# EAGLE design noisegen (EAGLE 6.1)
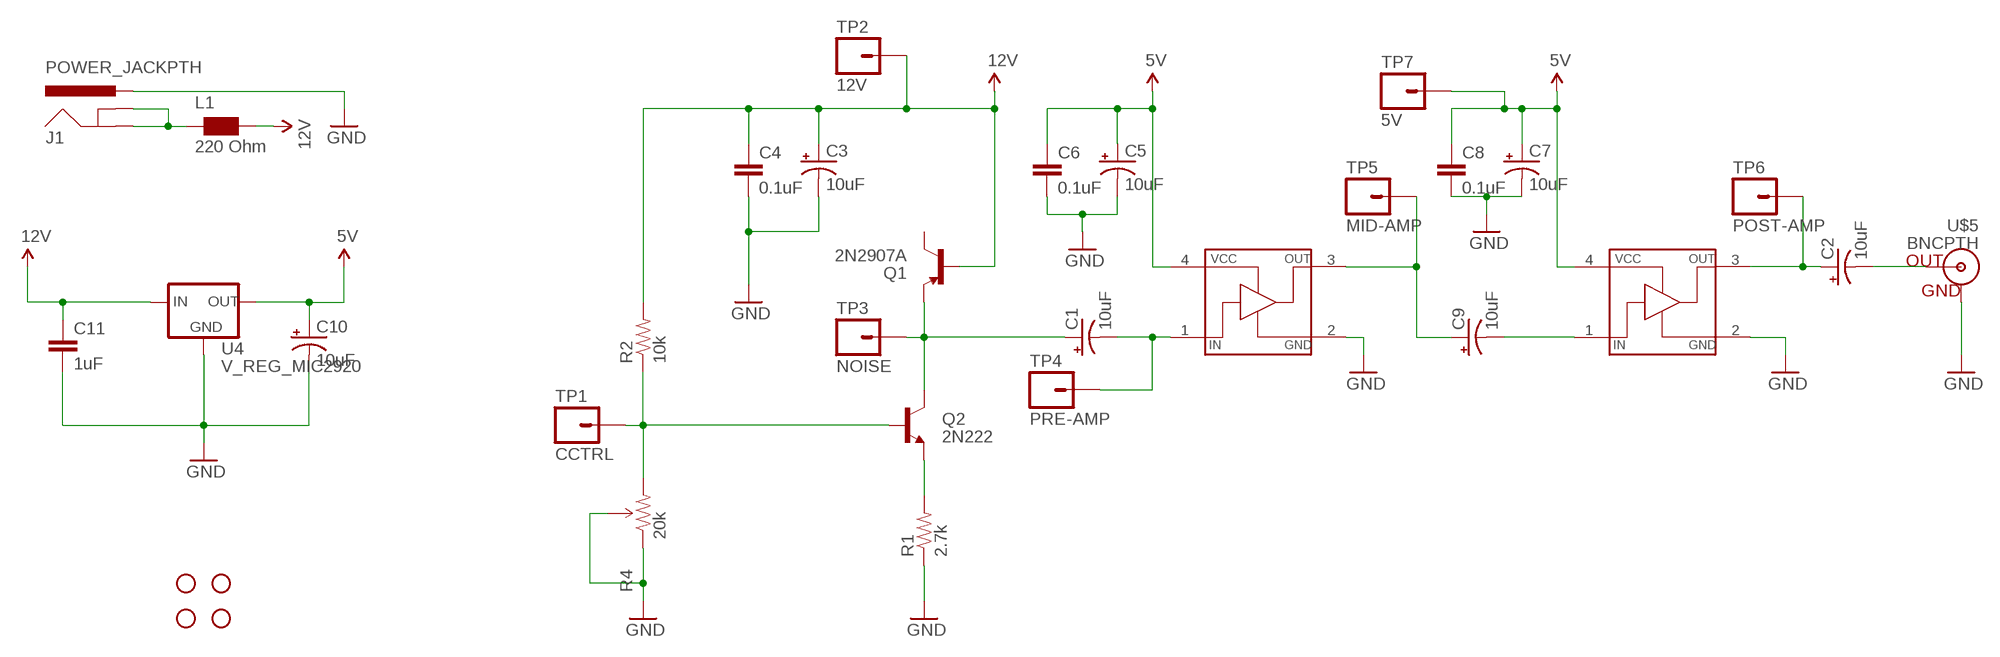
[diagram p0: schematic, sheet 1]

## Parts
C1  10uF  CAP_POL1206  [EIA3216]
C2  10uF  CAP_POL1206  [EIA3216]
C3  10uF  CAP_POL1206  [EIA3216]
C4  0.1uF  CAP0603-CAP  [0603-CAP]
C5  10uF  CAP_POL1206  [EIA3216]
C6  0.1uF  CAP0603-CAP  [0603-CAP]
C7  10uF  CAP_POL1206  [EIA3216]
C8  0.1uF  CAP0603-CAP  [0603-CAP]
C9  10uF  CAP_POL1206  [EIA3216]
C10  10uF  CAP_POL1206  [EIA3216]
C11  1uF  C-EUC0603  [C0603]
J1  POWER_JACKPTH  [POWER_JACK_PTH]
JP1  STAND-OFF  [STAND-OFF]
JP2  STAND-OFF  [STAND-OFF]
JP3  STAND-OFF  [STAND-OFF]
JP4  STAND-OFF  [STAND-OFF]
L1  220 Ohm  WE-CBF_0603  [0603]
Q1  2N2907A  TRANSISTOR_PNPSMD  [SOT23-3]
Q2  2N222  TRANSISTOR_NPNSOT23-3  [SOT23-3]
R1  2.7k  RESISTOR0603-RES  [0603-RES]
R2  10k  RESISTOR0603-RES  [0603-RES]
R4  20k  TRIMPOT  [3362U-2]
TP1  CCTRL  M01PTH  [1X01]
TP2  12V  M01PTH  [1X01]
TP3  NOISE  M01PTH  [1X01]
TP4  PRE-AMP  M01PTH  [1X01]
TP5  MID-AMP  M01PTH  [1X01]
TP6  POST-AMP  M01PTH  [1X01]
TP7  5V  M01PTH  [1X01]
U4  V_REG_MIC2920  [SOT223]
U$1  MAX2650  [SOT143]
U$2  MAX2650  [SOT143]
U$5  BNCPTH  [BNC]

## Nets
5V: C5.A(+) C6.1 C7.A(+) C8.1 C10.A(+) TP7.1 U4.3(OUT) U$1.4(VCC) U$2.4(VCC)
GND: C3.C(-) C4.2 C5.C(-) C6.2 C7.C(-) C8.2 C10.C(-) C11.2 J1.PWR R1.1 R4.1(CCW) R4.2(WIPER) U4.2(GND) U$1.2(GND) U$2.2(GND) U$5.GND
N$1: C9.C(-) U$2.1(IN)
N$2: C1.C(-) TP4.1 U$1.1(IN)
N$3: C2.A(+) TP6.1 U$2.3(OUT)
N$4: C1.A(+) Q1.2(E) Q2.3(C) TP3.1
N$5: Q2.2(E) R1.2
N$6: C2.C(-) U$5.S(OUT)
N$7: Q2.1(B) R2.1 R4.3(CW) TP1.1
N$8: C9.A(+) TP5.1 U$1.3(OUT)
N$9: J1.GND J1.GNDBREAK L1.1
VCC: C3.A(+) C4.1 C11.1 L1.2 Q1.1(B) R2.2 TP2.1 U4.1(IN) ; supply symbol labelled 12V
Unconnected: Q1.3(C)

## Library data of the parts
C1-C3 C5 C7 C9 C10 = sparkfun:CAP_POL: Capacitor Polarized These are standard SMD and PTH capacitors. Normally 10uF, 47uF, and 100uF in electrolytic and tantalum varieties. Always verify the external diameter of the through hole cap, it varies with capacity, voltage, and manufacturer. The EIA devices should be standard.
C4 C6 C8 = sparkfun:CAP: Capacitor Standard 0603 ceramic capacitor, and 0.1" leaded capacitor.
C11 = rcl:C-EU: CAPACITOR, European symbol
J1 = sparkfun:POWER_JACK: Power Jack This is the standard 5.5mm barrel jack for power. The PTH is the most common, proven, reliable, footprint. All others are experimental. The Slot footprint only works if the mill layer is transmitted to the PCB fab house so be warned. Spark Fun Electronics SKU : PRT-00119. Mating wall wart : TOL-00298 (and others)
JP1-JP4 = sparkfun:STAND-OFF: Stand Off This is the mechanical footprint for a #4 phillips button head screw. Use the keepout ring to avoid running the screw head into surrounding components. SKU : PRT-00447
L1 = wuerth-elektronik:WE-CBF: SMD EMI Suppression Ferrite Beads - excellent anti-EMI properties - low DCR - impedances till 3000 ohms - rated current up to 6 A
Q1 = sparkfun:TRANSISTOR_PNP
Q2 = sparkfun:TRANSISTOR_NPN: Transistor NPN BJT configuration in SOT23 package. MMBT2222 is the common NPN we use. Double check BCE configuration again layout.
R1 R2 = sparkfun:RESISTOR: Resistor Basic schematic elements and footprints for 0603, 1206, and PTH resistors.
R4 = sparkfun:TRIMPOT
TP1-TP7 = sparkfun:M01: Header 1 Standard 1-pin 0.1" header. Use with straight break away headers (SKU : PRT-00116), right angle break away headers (PRT-00553), swiss pins (PRT-00743), machine pins (PRT-00117), and female headers (PRT-00115).
U4 = sparkfun:V_REG_MIC2920: MIC2920A (http://www.micrel.com/_PDF/mic2920.pdf) - 400mA output LDO Regulator
U$1 U$2 = custom:MAX2650
U$5 = sparkfun:BNC: BNC Connector, Mouser Part# 5227161

## Board
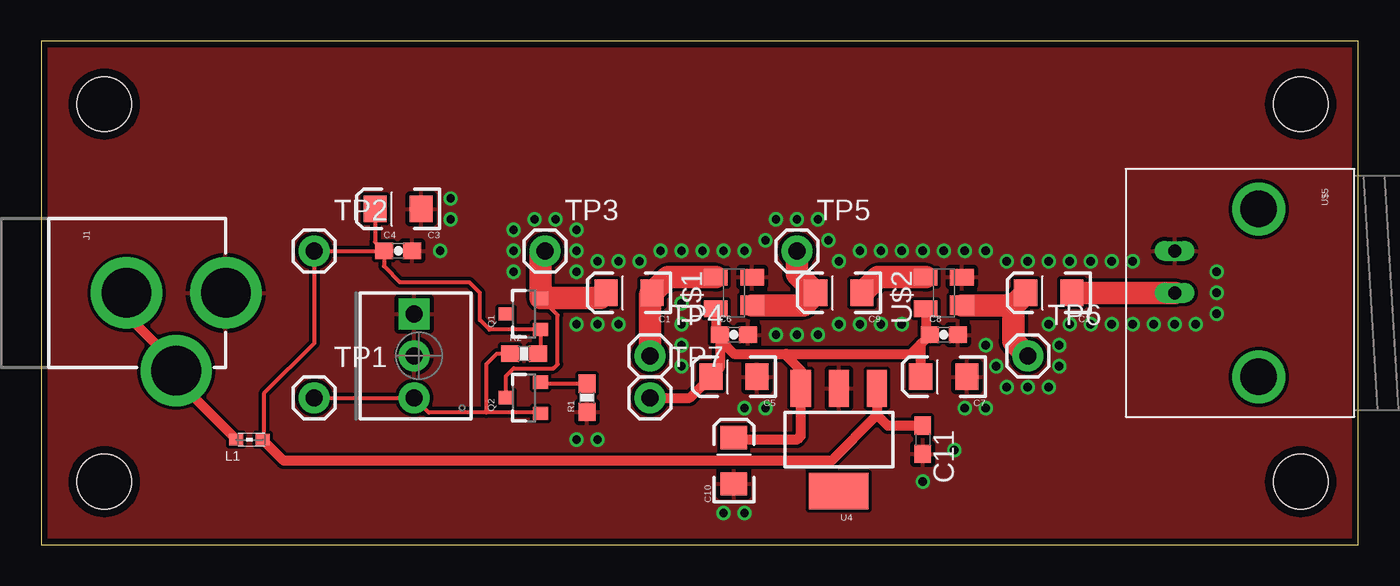
[diagram p1: board, top side]
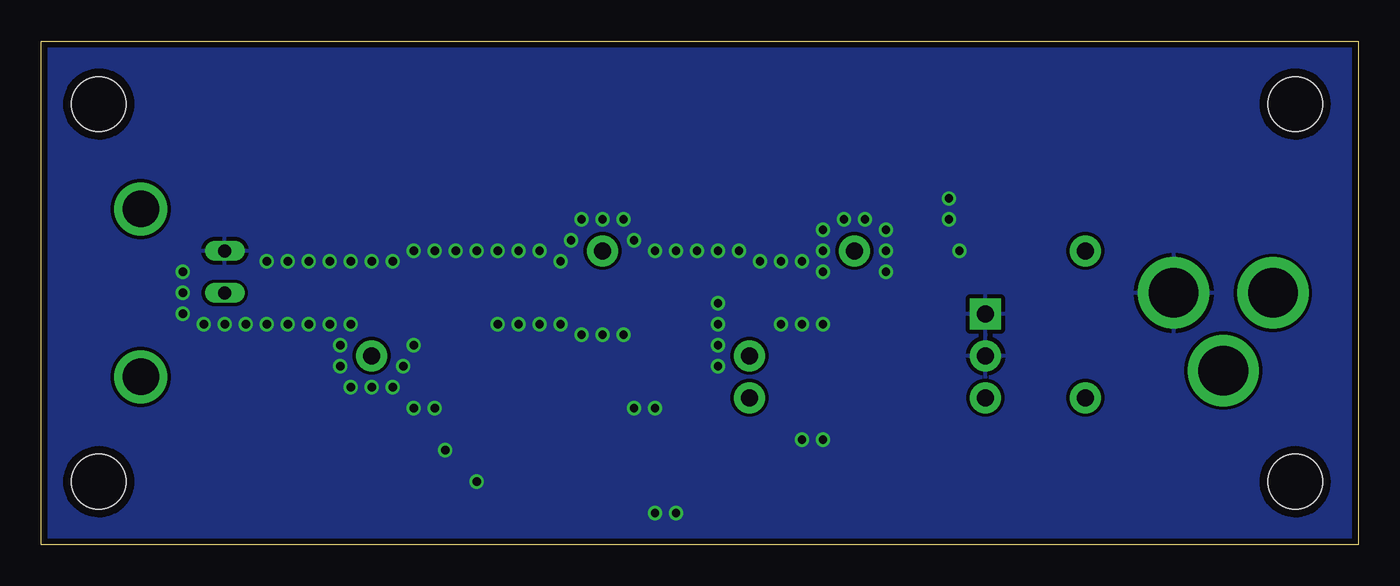
[diagram p2: board, bottom side, seen from below]

Size 79.68 x 30.47 mm. Coordinates in mm from the lower left corner, seen from the top.
Outline: 0,0 79.68,0 79.68,30.47 0,30.47 0,0
Copper layers (1*16): Top 0.0356mm / dielectric 1.5011mm / Bottom 0.0356mm
Design rules: minimum track width 6mil, minimum drill 13mil, track to track 6mil, track to pad 6mil, pad to pad 6mil, via to via 6mil, smd to smd 6mil, copper to edge 15mil, drill to drill 6mil, minimum pad ring 7mil, minimum via ring 7mil, stop-mask expansion 4mil, vias tented up to drill 0mil, thermal gap 10mil

### Footprints (pad centres in the part's own frame; a part is rotated, then mirrored left to right if it is on the bottom)
EIA3216 = smd 1.4 x 1.6: A 1.4,0; C -1.4,0
0603-CAP = smd 1.1 x 1: 1 -0.85,0; 2 0.85,0
C0603 = smd 1.1 x 1: 1 -0.85,0; 2 0.85,0
POWER_JACK_PTH = drill 2.997 pad 4.318: GND 0,7.7; GNDBREAK 4.7,10.7; PWR 0,13.7
STAND-OFF = hole 3.302: 0,0
0603 = smd 0.85 x 0.7: 1 -0.9,0; 2 0.7,0
SOT23-3 = smd 0.8 x 0.9: 1 -0.95,-1; 2 0.95,-1; 3 0,1.1
0603-RES = smd 1.1 x 1: 1 -0.85,0; 2 0.85,0
3362U-2 = drill 1.016 pad 1.88 square: 1 -2.54,-0.305 | drill 1.016 pad 1.88: 2 0,-0.305; 3 2.54,-0.305
1X01 = drill 1.016 pad 1.88: 1 0,0
SOT223 = smd 1.219 x 2.235: 1 -2.311,-3.099; 2 0,-3.099; 3 2.311,-3.099 | smd 3.6 x 2.2: 4 0,3.099
SOT143 = smd 1 x 1.44: 1 0.95,1.1; 2 0.95,-1.1; 4 -0.95,1.1 | smd 1.2 x 1.44: 3 -0.75,-1.1
BNC = drill 2.2: 3 -5.08,5.08; 4 5.08,5.08 | drill 0.8 long: GND -2.54,0; S 0,0

### Placement (x,y rotation side)
C1  35.56,15.24 180 top
C2  60.96,15.24 180 top
C3  21.59,20.32 180 top
C4  21.59,17.78 0 top
C5  41.91,10.16 180 top
C6  41.91,12.7 0 top
C7  54.61,10.16 180 top
C8  54.61,12.7 0 top
C9  48.26,15.24 180 top
C10  41.91,5.08 90 top
C11  53.34,6.35 270 top
J1  -2.54,15.24 270 top
JP1  3.81,26.67 0 top
JP2  3.81,3.81 0 top
JP3  76.2,26.67 0 top
JP4  76.2,3.81 0 top
L1  12.7,6.35 0 top
Q1  29.21,13.97 90 top
Q2  29.21,8.89 90 top
R1  33.02,8.89 90 top
R2  29.21,11.56 0 top
R4  22.86,11.43 270 top
TP1  16.51,8.89 0 top
TP2  16.51,17.78 0 top
TP3  30.48,17.78 0 top
TP4  36.83,11.43 0 top
TP5  45.72,17.78 0 top
TP6  59.69,11.43 0 top
TP7  36.83,8.89 0 top
U4  48.26,6.35 180 top
U$1  41.91,15.24 90 top
U$2  54.61,15.24 90 top
U$5  68.58,15.24 270 top

### Tracks (layer width: path | path; a pad name or v marks a point on that pad's centre or on a via)
5V
  Top 0.254: 53.51,12.95 C8.1 | C6.1 41.06,12.41 | C10.A 41.91,6.98
  Top 0.61: C7.A 53.21,12.15 | 53.21,12.15 C8.1 | U$2.4 53.51,12.95 | U$1.4 40.81,12.95 C6.1 41.06,10.71 C5.A 39.24,8.89 TP7.1 | 41.06,12.41 41.91,11.56 45.09,11.56 | 45.09,11.56 52.62,11.56 53.21,12.15 | C10.A 42.04,6.35 45.72,6.35 45.95,6.58 U4.3 45.95,9.93 | 45.95,9.93 45.72,10.16 | 45.95,9.93 45.95,10.57 45.09,11.43 45.09,11.56
GND  (via drill 0.51)
  other vias: 44.45,12.7 45.72,12.7 46.99,12.7 48.26,13.34 49.53,13.34 50.8,13.34 52.07,13.34 38.73,14.61 38.73,13.34 38.73,12.07 38.73,10.8 33.66,6.35 32.38,6.35 24.77,20.96 24.77,19.68 24.13,17.78 28.58,16.51 28.58,17.78 28.58,19.05 29.84,19.68 31.12,19.68 32.38,19.05 32.38,17.78 32.38,16.51 32.38,13.34 33.66,13.34 34.92,13.34 33.66,17.14 34.92,17.14 36.2,17.14 37.46,17.78 38.73,17.78 40.01,17.78 41.27,17.78 42.55,17.78 43.82,18.41 44.45,19.68 45.72,19.68 46.99,19.68 47.62,18.41 48.26,17.14 49.53,17.78 50.8,17.78 52.07,17.78 53.34,17.78 54.61,17.78 55.88,17.78 57.15,17.78 58.42,17.14 59.69,17.14 60.96,17.14 62.23,17.14 63.5,17.14 64.77,17.14 66.04,17.14 71.12,16.51 71.12,15.24 71.12,13.97 69.85,13.34 68.58,13.34 67.31,13.34 66.04,13.34 64.77,13.34 63.5,13.34 62.23,13.34 60.96,13.34 61.6,12.07 61.6,10.8 60.96,9.53 59.69,9.53 58.42,9.53 57.79,10.8 57.15,12.07 57.15,8.25 55.88,8.25 42.55,8.25 43.82,8.25 41.27,1.91 42.55,1.91 53.34,3.81 55.24,5.71
  pour Bottom (isolate 0.2): 80.01,30.48 0,30.48 0,0 80.01,0
  pour Top (isolate 0.2): 80.01,30.48 0,30.48 0,0 80.01,0
N$1
  Top 1.35: U$2.1 50.61,16.19 C9.C
N$2
  Top 0.254: 36.83,15.11 C1.C
  Top 1.35: U$1.1 37.91,16.19 C1.C | TP4.1 36.83,15.11
N$3
  Top 1.35: U$2.3 58.81,14.49 | 58.81,14.49 C2.A | 58.81,14.49 58.81,12.31 TP6.1
N$4
  Top 0.254: 33.84,14.92 C1.A | Q2.3 28.11,10.2 28.58,10.67 30.99,10.67 31.24,10.92 31.24,13.89 Q1.2
  Top 1.35: 33.84,14.92 Q1.2 30.21,17.51 TP3.1
N$5
  Top 0.254: R1.2 30.31,9.74 Q2.2
N$6
  Top 1.35: U$5.S C2.C
N$7
  Top 0.254: 26.92,8 30.15,8 Q2.1 | 26.92,8 23.44,8 R4.3 TP1.1 | R2.1 27.56,11.56 26.92,10.92 26.92,8
N$8
  Top 1.35: U$1.3 46.11,14.49 C9.A 45.72,16.38 TP5.1
N$9
  Top 0.254: L1.1 11.62,6.54
  Top 0.61: J1.GND 5.16,13.89 8.51,10.54 | J1.GNDBREAK 8.51,10.54 | 8.51,10.54 8.89,10.16 8.89,9.27 11.62,6.54 L1.1
VCC
  Top 0.254: C3.A 20.19,18.33 C4.1 | C4.1 20.74,16.85 21.72,15.88 25.91,15.88 26.54,15.24 26.54,13.59 27.11,13.02 Q1.1 30.21,11.58 R2.2 | C4.1 TP2.1 16.51,12.19 13.46,9.14 13.46,6.41 L1.2
  Top 0.61: U4.1 50.57,7.85 | C11.1 51.22,7.2 50.57,7.85 | 50.57,7.85 47.8,5.08 14.67,5.08 L1.2